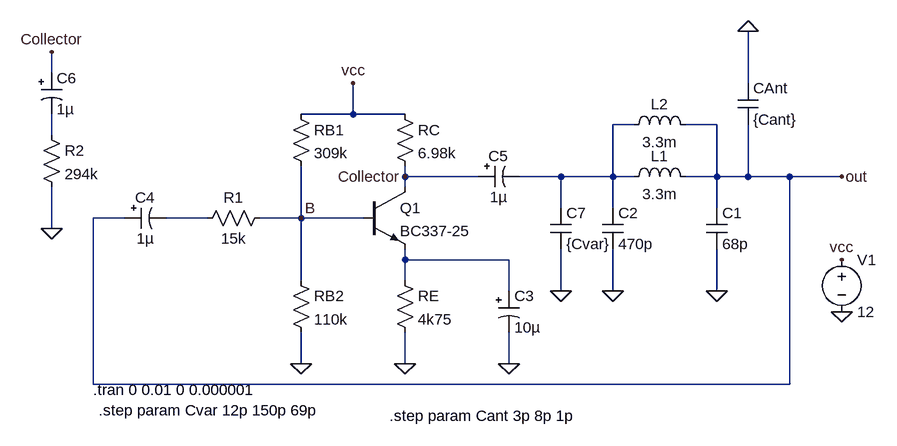
[diagram p0: schematic AntennaOscilator.asc]
AntennaOscilator.asc, the LTspice schematic file:
Version 4
SHEET 1 1408 680
WIRE -528 -48 -528 -80
WIRE 544 -32 544 -112
WIRE -64 16 -64 -32
WIRE -64 16 -144 16
WIRE 16 16 -64 16
WIRE 368 32 336 32
WIRE 496 32 448 32
WIRE -528 48 -528 16
WIRE 16 112 16 96
WIRE 128 112 16 112
WIRE 256 112 192 112
WIRE 336 112 336 32
WIRE 336 112 256 112
WIRE 368 112 336 112
WIRE 496 112 496 32
WIRE 496 112 448 112
WIRE 544 112 544 32
WIRE 544 112 496 112
WIRE 608 112 544 112
WIRE 688 112 608 112
WIRE 16 128 16 112
WIRE 256 160 256 112
WIRE 336 160 336 112
WIRE 496 160 496 112
WIRE -416 176 -464 176
WIRE -288 176 -352 176
WIRE -144 176 -144 96
WIRE -144 176 -208 176
WIRE -48 176 -144 176
WIRE -528 192 -528 128
WIRE 16 240 16 224
WIRE 176 240 16 240
WIRE -144 272 -144 176
WIRE 16 272 16 240
WIRE 176 288 176 240
WIRE 256 288 256 224
WIRE 336 288 336 224
WIRE 496 288 496 224
WIRE -144 400 -144 352
WIRE 16 400 16 352
WIRE 176 400 176 352
WIRE -464 432 -464 176
WIRE 608 432 608 112
WIRE 608 432 -464 432
FLAG -64 -32 vcc
FLAG 688 240 vcc
FLAG 688 320 0
FLAG 176 400 0
FLAG 16 400 0
FLAG -144 400 0
FLAG 16 112 Collector
FLAG -528 192 0
FLAG -144 176 B
FLAG 496 288 0
FLAG 336 288 0
FLAG 688 112 out
FLAG 544 -112 0
FLAG -528 -80 Collector
FLAG 256 288 0
SYMBOL res -160 0 R0
SYMATTR InstName RB1
SYMATTR Value 309k
SYMBOL res 0 0 R0
SYMATTR InstName RC
SYMATTR Value 6.98k
SYMBOL res 0 256 R0
SYMATTR InstName RE
SYMATTR Value 4k75
SYMBOL res -160 256 R0
SYMATTR InstName RB2
SYMATTR Value 110k
SYMBOL polcap 160 288 R0
SYMATTR InstName C3
SYMATTR Value 10µ
SYMBOL voltage 688 224 R0
WINDOW 123 0 0 Left 0
WINDOW 39 0 0 Left 0
SYMATTR InstName V1
SYMATTR Value 12
SYMBOL polcap -544 -48 R0
SYMATTR InstName C6
SYMATTR Value 1µ
SYMBOL res -544 32 R0
SYMATTR InstName R2
SYMATTR Value 294k
SYMBOL npn -48 128 R0
SYMATTR InstName Q1
SYMATTR Value BC337-25
SYMBOL res -192 160 R90
WINDOW 0 0 56 VBottom 2
WINDOW 3 32 56 VTop 2
SYMATTR InstName R1
SYMATTR Value 15k
SYMBOL ind 464 128 M270
WINDOW 0 32 56 VTop 2
WINDOW 3 5 56 VBottom 2
SYMATTR InstName L1
SYMATTR Value 3.3m
SYMBOL cap 480 160 R0
SYMATTR InstName C1
SYMATTR Value 68p
SYMBOL cap 320 160 R0
SYMATTR InstName C2
SYMATTR Value 470p
SYMBOL cap 528 -32 R0
SYMATTR InstName CAnt
SYMATTR Value {Cant}
SYMBOL polcap -416 160 M90
WINDOW 0 0 32 VBottom 2
WINDOW 3 32 32 VTop 2
SYMATTR InstName C4
SYMATTR Value 1µ
SYMBOL polcap 128 96 M90
WINDOW 0 0 32 VBottom 2
WINDOW 3 32 32 VTop 2
SYMATTR InstName C5
SYMATTR Value 1µ
SYMBOL ind 352 48 R270
WINDOW 0 32 56 VTop 2
WINDOW 3 5 56 VBottom 2
SYMATTR InstName L2
SYMATTR Value 3.3m
SYMBOL cap 240 160 R0
SYMATTR InstName C7
SYMATTR Value {Cvar}
TEXT -464 440 Left 2 !.tran 0 0.01 0 0.000001
TEXT -456 472 Left 2 !.step param Cvar 12p 150p 69p
TEXT -8 480 Left 2 !.step param Cant 3p 8p 1p

The netlist it stands for:
* AntennaOscilator.asc
RB1 vcc B 309k
RC vcc Collector 6.98k
RE N004 0 4k75
RB2 B 0 110k
C3 N004 0 10µ
V1 vcc 0 12
C6 Collector N002 1µ
R2 N002 0 294k
Q1 Collector B N004 0 BC337-25
R1 B N003 15k
L1 out N001 3.3m
C1 out 0 68p
C2 N001 0 470p
CAnt 0 out {Cant}
C4 out N003 1µ
C5 Collector N001 1µ
L2 N001 out 3.3m
C7 N001 0 {Cvar}
.model NPN NPN
.model PNP PNP
.lib standard.bjt
.tran 0 0.01 0 0.000001
.step param Cvar 12p 150p 69p
.step param Cant 3p 8p 1p
.backanno
.end